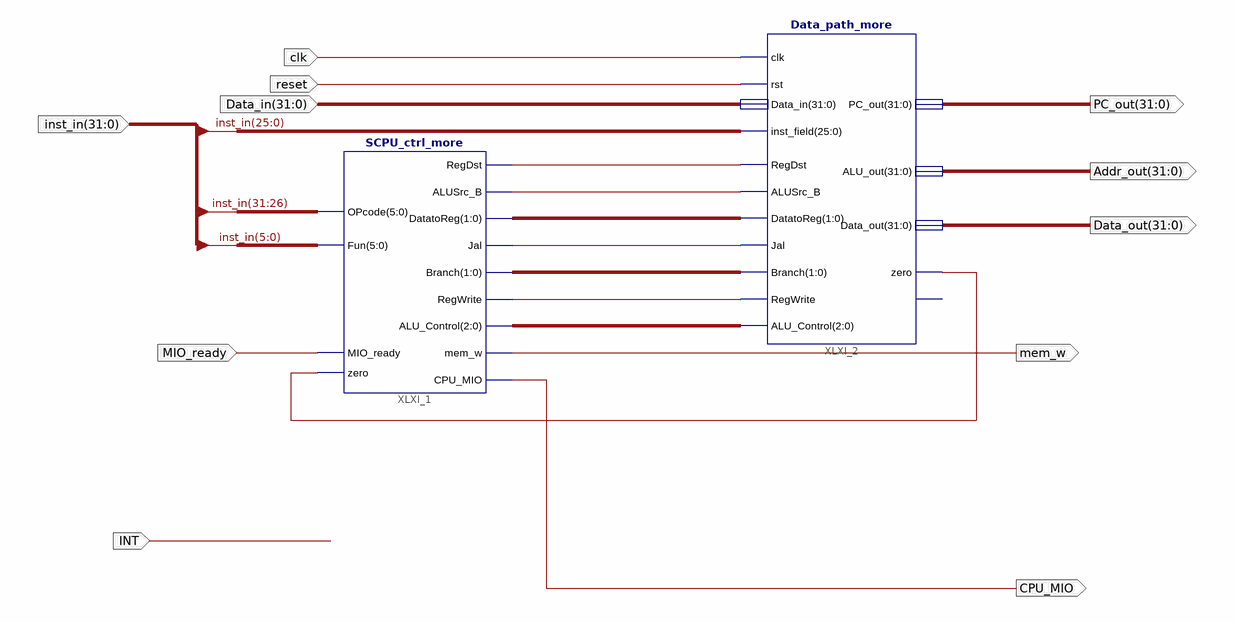
[diagram p0: schematic sheet 1]
// Xilinx ISE schematic SCPU_More.sch (kintex7) as structural Verilog: 2 symbols, 11 ports
module SCPU_More (
  input  clk,
  input  reset,
  input  [31:0] Data_in,
  input  MIO_ready,
  input  INT,
  input  [31:0] inst_in,
  output mem_w,
  output CPU_MIO,
  output [31:0] PC_out,
  output [31:0] Addr_out,
  output [31:0] Data_out
);

  wire XLXN_5, XLXN_6, XLXN_8, XLXN_10, XLXN_13;
  wire [1:0] XLXN_7, XLXN_9;
  wire [2:0] XLXN_11;

  SCPU_ctrl_more XLXI_1 (
    .RegDst(XLXN_5), .ALUSrc_B(XLXN_6), .DatatoReg(XLXN_7), .Jal(XLXN_8), .ALU_Control(XLXN_11),
    .CPU_MIO(CPU_MIO), .mem_w(mem_w), .Fun(inst_in[5:0]), .OPcode(inst_in[31:26]), .Branch(XLXN_9),
    .RegWrite(XLXN_10), .MIO_ready(MIO_ready), .zero(XLXN_13));
  Data_path_more XLXI_2 (
    .RegDst(XLXN_5), .ALUSrc_B(XLXN_6), .DatatoReg(XLXN_7), .Jal(XLXN_8), .Branch(XLXN_9),
    .RegWrite(XLXN_10), .ALU_Control(XLXN_11), .Data_in(Data_in), .inst_field(inst_in[25:0]), .clk(clk),
    .rst(reset), .PC_out(PC_out), .ALU_out(Addr_out), .Data_out(Data_out), .zero(XLXN_13));  // open: overflow
endmodule
